# EAGLE board Control board FINAL (EAGLE 6.2), part 1 of 2
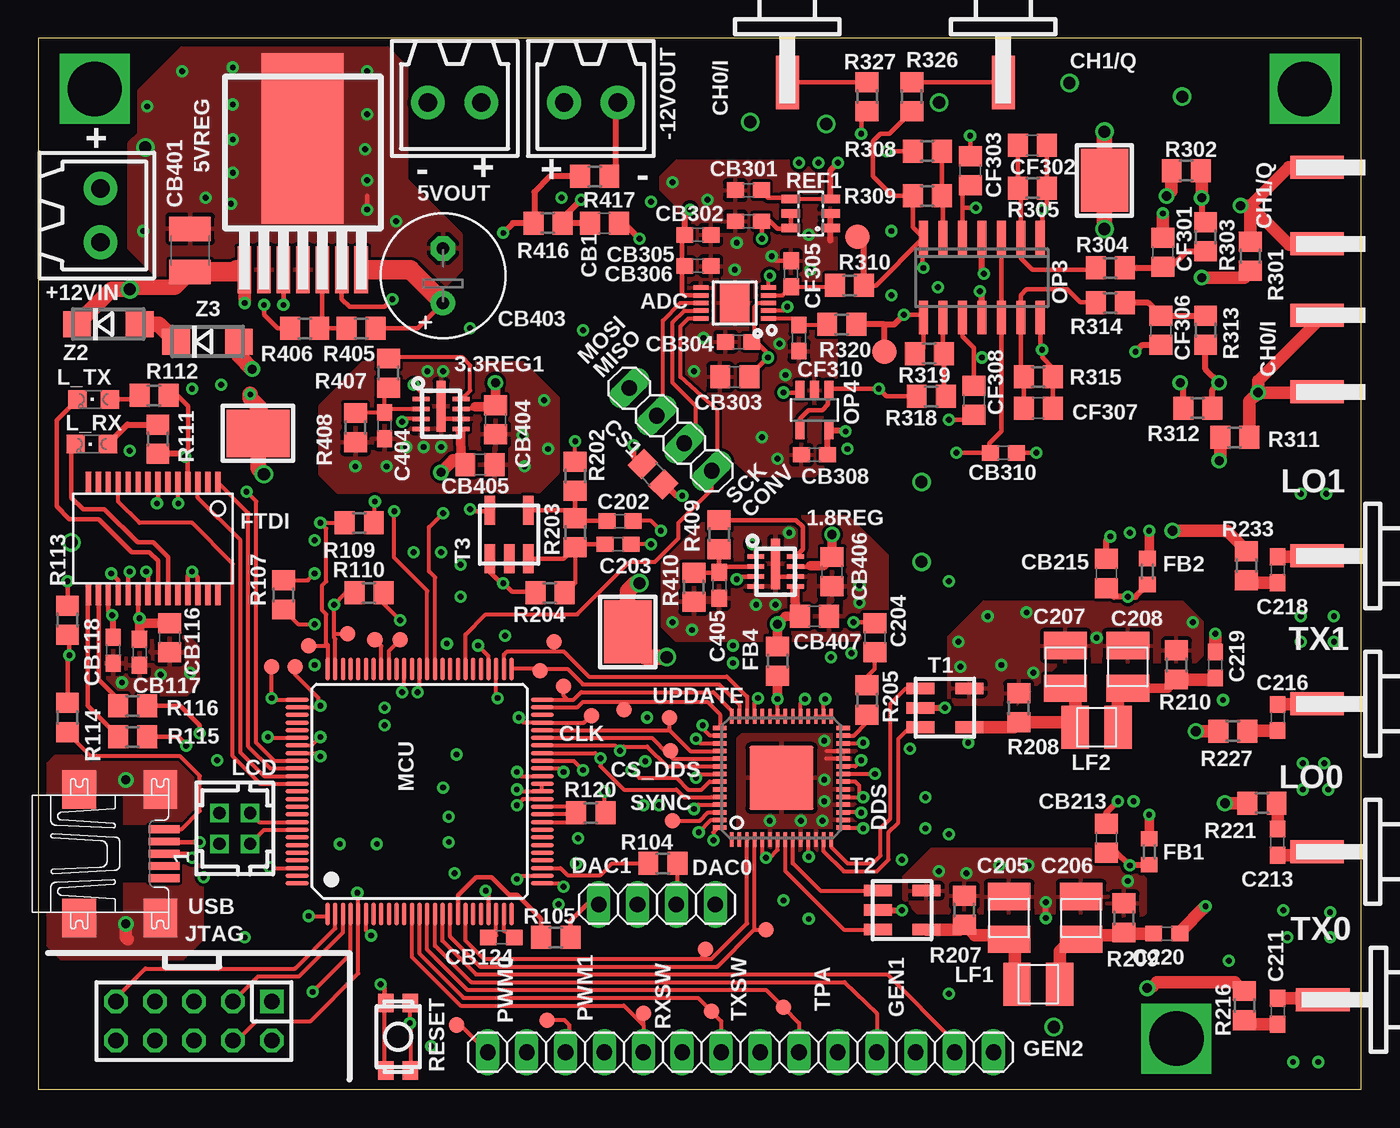
[diagram p4: board, top side]
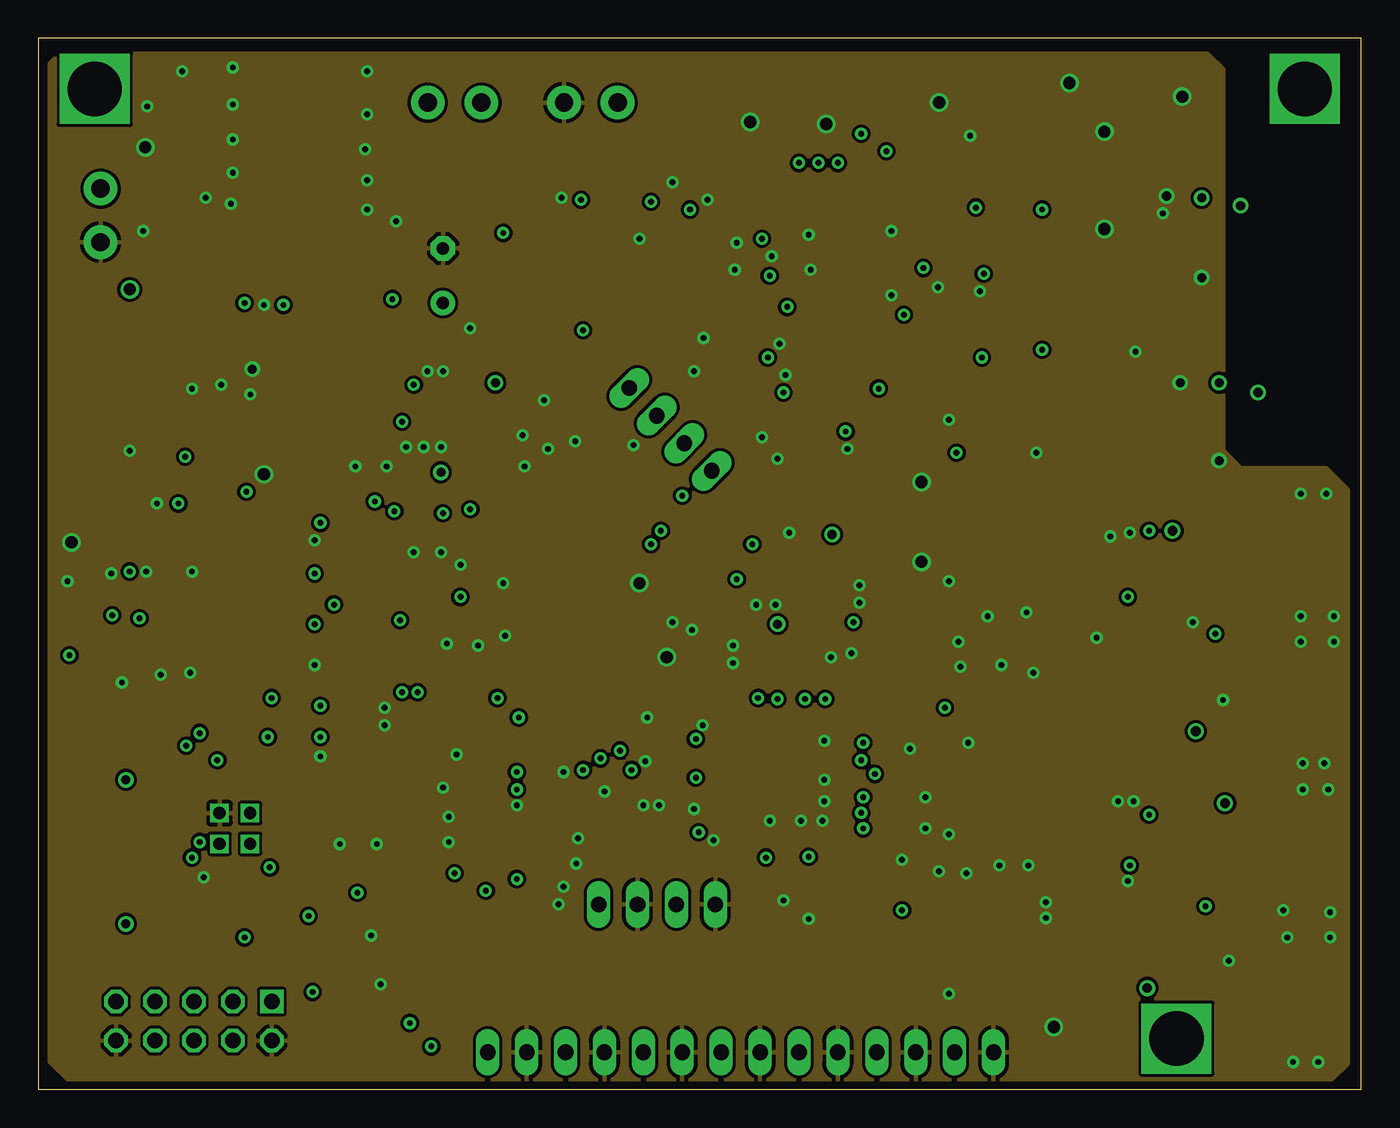
[diagram p5: board, inner layer Route2]
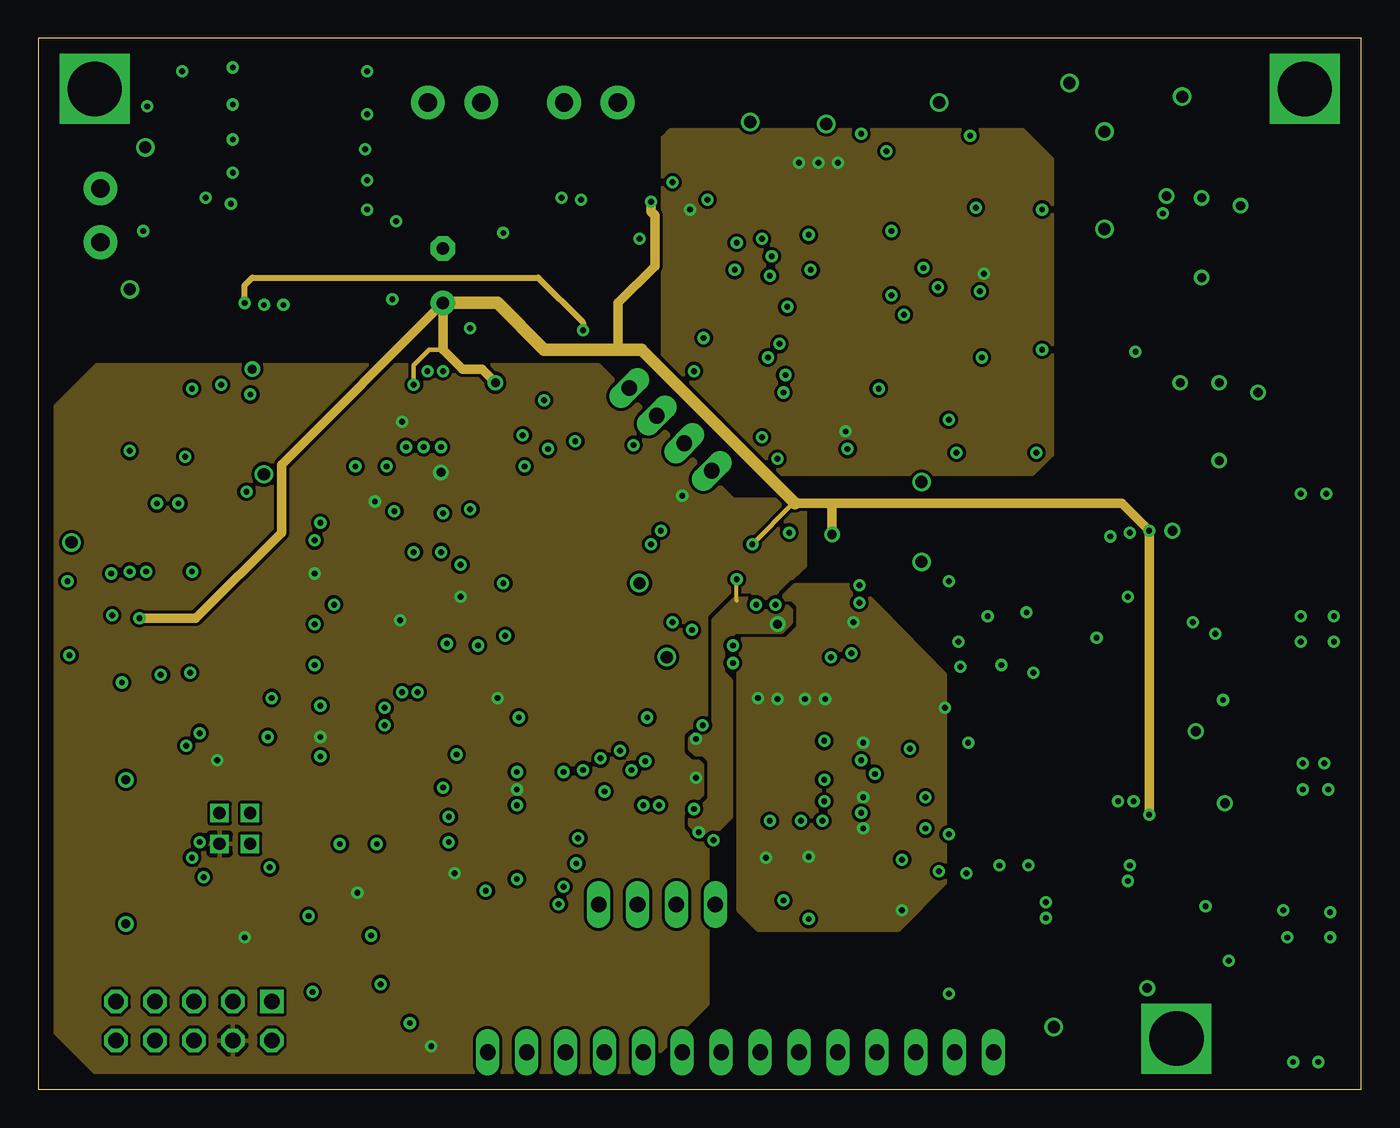
[diagram p6: board, inner layer Route15]
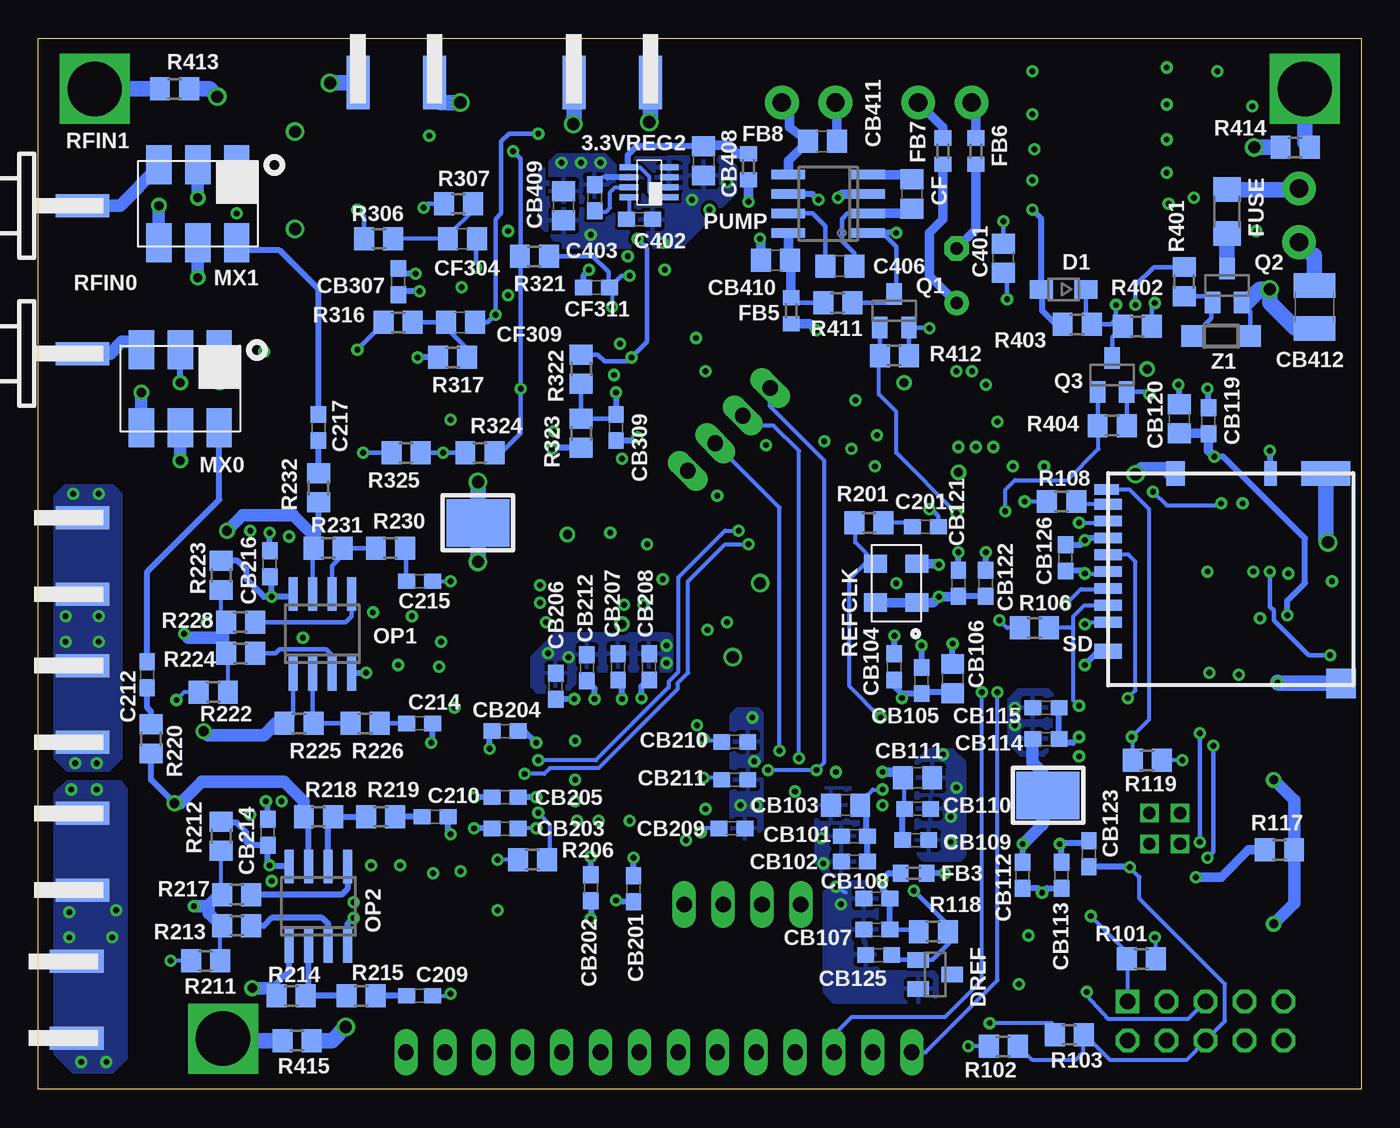
[diagram p7: board, bottom side, seen from below]

Size 86.36 x 68.58 mm. Coordinates in mm from the lower left corner, seen from the top.
Outline: 0,0 86.36,0 86.36,68.58 0,68.58 0,0
Copper layers (1*2+15*16): Top 0.035mm / dielectric 1.5mm / Route2 0.035mm / dielectric 0.15mm / Route15 0.035mm / dielectric 0.2mm / Bottom 0.035mm
Design rules: minimum track width 8mil, minimum drill 15mil, track to track 8mil, track to pad 8mil, pad to pad 8mil, via to via 8mil, smd to smd 8mil, copper to edge 20mil, drill to drill 8mil, minimum pad ring 8mil, minimum via ring 8mil, stop-mask expansion 2mil, vias tented up to drill 15mil, thermal gap 10mil
Net classes: 1 Highspeed digital: width 0.254 mm, drill 0.254 mm, clearance 0.203 mm; 2 Lowspeed digital: width 0.254 mm, drill 0.254 mm, clearance 0.203 mm

## Footprints (pad centres in the part's own frame; a part is rotated, then mirrored left to right if it is on the bottom)
LLP-8 = smd 0.6 x 3.3: EP 0,0.5 | smd 1.1 x 0.3: P$1 -1.3,0.975; P$2 -1.3,0.325; P$3 -1.3,-0.325; P$4 -1.3,-0.975; P$5 1.3,-0.975; P$6 1.3,-0.325; P$7 1.3,0.325; P$8 1.3,0.975
TSOT-8 = smd 0.4 x 1.22: 1 -0.975,-1.31; 2 -0.325,-1.31; 3 0.325,-1.31; 4 0.975,-1.31; 5 0.975,1.31; 6 0.325,1.31; 7 -0.325,1.31; 8 -0.975,1.31
OMNIMATE_SL_2POS = drill 1.2 pad 2.2: 1 -1.75,0; 2 1.75,0
TO-PMOD7 = smd 5.35 x 11.15: EP 0,8.575 | smd 0.9 x 3.07: P$1 -3.81,0; P$2 -2.54,0; P$3 -1.27,0; P$4 0,0; P$5 1.27,0; P$6 2.54,0; P$7 3.81,0
MSOP-10-EXP = smd 0.292 x 1: 1 -1,-2.2; 2 -0.5,-2.2; 3 0,-2.2; 4 0.5,-2.2; 5 1,-2.2; 6 1,2.2; 7 0.5,2.2; 8 0,2.2; 9 -0.5,2.2; 10 -1,2.2 | smd 2.5 x 1.9: EXP 0,0
C0603 = smd 1.1 x 1: 1 -0.85,0; 2 0.85,0
C0805 = smd 1.3 x 1.5: 1 -0.95,0; 2 0.95,0
1008 = smd 1.778 x 2.794: P$1 -1.397,0; P$2 1.397,0
C1210 = smd 1.6 x 2.7: 1 -1.4,0; 2 1.4,0
E3,5-8 = drill 0.813 pad 1.6: + -1.778,0 | drill 0.813 pad 1.6 octagon: - 1.778,0
SMC-EDGE = smd 3.5 x 1.5: 1 3.14,0 | smd 3.5 x 1.5 bottom: 2 3.14,2.5; 3 3.14,-2.5
TP10R = smd 1 x 1: TP 0,0
SOD323-W = smd 1.5 x 1.2: A 1.45,0; C -1.45,0
LFCSP-56 = smd 0.95 x 0.279: 1 -4.025,3.25; 2 -4.025,2.75; 3 -4.025,2.25; 4 -4.025,1.75; 5 -4.025,1.25; 6 -4.025,0.75; 7 -4.025,0.25; 8 -4.025,-0.25; 9 -4.025,-0.75; 10 -4.025,-1.25; 11 -4.025,-1.75; 12 -4.025,-2.25; 13 -4.025,-2.75; 14 -4.025,-3.25; 29 4.025,-3.25; 30 4.025,-2.75; 31 4.025,-2.25; 32 4.025,-1.75; 33 4.025,-1.25; 34 4.025,-0.75; 35 4.025,-0.25; 36 4.025,0.25; 37 4.025,0.75; 38 4.025,1.25; 39 4.025,1.75; 40 4.025,2.25; 41 4.025,2.75; 42 4.025,3.25 | smd 0.279 x 0.95: 15 -3.25,-4.025; 16 -2.75,-4.025; 17 -2.25,-4.025; 18 -1.75,-4.025; 19 -1.25,-4.025; 20 -0.75,-4.025; 21 -0.25,-4.025; 22 0.25,-4.025; 23 0.75,-4.025; 24 1.25,-4.025; 25 1.75,-4.025; 26 2.25,-4.025; 27 2.75,-4.025; 28 3.25,-4.025; 43 3.25,4.025; 44 2.75,4.025; 45 2.25,4.025; 46 1.75,4.025; 47 1.25,4.025; 48 0.75,4.025; 49 0.25,4.025; 50 -0.25,4.025; 51 -0.75,4.025; 52 -1.25,4.025; 53 -1.75,4.025; 54 -2.25,4.025; 55 -2.75,4.025; 56 -3.25,4.025 | smd 4.2 x 4.2: EXP 0,0
SOT23-3 = smd 1 x 1.4: 1 -0.95,-1.1; 2 0.95,-1.1; 3 0,1.1
R0603 = smd 1 x 1.1: 1 -0.85,0; 2 0.85,0
R0805 = smd 1.3 x 1.5: 1 -0.95,0; 2 0.95,0
SSOP28DB = smd 0.348 x 1.397: 1 -4.225,-3.656; 2 -3.575,-3.656; 3 -2.925,-3.656; 4 -2.275,-3.656; 5 -1.625,-3.656; 6 -0.975,-3.656; 7 -0.325,-3.656; 8 0.325,-3.656; 9 0.975,-3.656; 10 1.625,-3.656; 11 2.275,-3.656; 12 2.925,-3.656; 13 3.575,-3.656; 14 4.225,-3.656; 15 4.225,3.656; 16 3.575,3.656; 17 2.925,3.656; 18 2.275,3.656; 19 1.625,3.656; 20 0.975,3.656; 21 0.325,3.656; 22 -0.325,3.656; 23 -0.975,3.656; 24 -1.625,3.656; 25 -2.275,3.656; 26 -2.925,3.656; 27 -3.575,3.656; 28 -4.225,3.656
R1206 = smd 1.6 x 1.803: 1 -1.422,0; 2 1.422,0
1X04 = drill 1.016 long: 1 -3.81,0; 2 -1.27,0; 3 1.27,0; 4 3.81,0
1X14 = drill 1.016 long: 1 -16.51,0; 2 -13.97,0; 3 -11.43,0; 4 -8.89,0; 5 -6.35,0; 6 -3.81,0; 7 -1.27,0; 8 1.27,0; 9 3.81,0; 10 6.35,0; 11 8.89,0; 12 11.43,0; 13 13.97,0; 14 16.51,0
AVR-JTAG-10 = drill 1.016 square: 1 -5.08,-1.27 | drill 1.016 octagon: 2 -5.08,1.27; 3 -2.54,-1.27; 4 -2.54,1.27; 5 0,-1.27; 6 0,1.27; 7 2.54,-1.27; 8 2.54,1.27; 9 5.08,-1.27; 10 5.08,1.27
CHIPLED_0805 = smd 1.2 x 1.2: A 0,-1.05; C 0,1.05
DF11-4POS = drill 0.8 square: 1 1,-1; 2 1,1; 3 -1,-1; 4 -1,1
TQFP100 = smd 1.499 x 0.279: 1 -8,6; 2 -8,5.5; 3 -8,5; 4 -8,4.5; 5 -8,4; 6 -8,3.5; 7 -8,3; 8 -8,2.5; 9 -8,2; 10 -8,1.5; 11 -8,1; 12 -8,0.5; 13 -8,0; 14 -8,-0.5; 15 -8,-1; 16 -8,-1.5; 17 -8,-2; 18 -8,-2.5; 19 -8,-3; 20 -8,-3.5; 21 -8,-4; 22 -8,-4.5; 23 -8,-5; 24 -8,-5.5; 25 -8,-6; 51 8,-6; 52 8,-5.5; 53 8,-5; 54 8,-4.5; 55 8,-4; 56 8,-3.5; 57 8,-3; 58 8,-2.5; 59 8,-2; 60 8,-1.5; 61 8,-1; 62 8,-0.5; 63 8,0; 64 8,0.5; 65 8,1; 66 8,1.5; 67 8,2; 68 8,2.5; 69 8,3; 70 8,3.5; 71 8,4; 72 8,4.5; 73 8,5; 74 8,5.5; 75 8,6 | smd 0.279 x 1.499: 26 -6,-8; 27 -5.5,-8; 28 -5,-8; 29 -4.5,-8; 30 -4,-8; 31 -3.5,-8; 32 -3,-8; 33 -2.5,-8; 34 -2,-8; 35 -1.5,-8; 36 -1,-8; 37 -0.5,-8; 38 0,-8; 39 0.5,-8; 40 1,-8; 41 1.5,-8; 42 2,-8; 43 2.5,-8; 44 3,-8; 45 3.5,-8; 46 4,-8; 47 4.5,-8; 48 5,-8; 49 5.5,-8; 50 6,-8; 76 6,8; 77 5.5,8; 78 5,8; 79 4.5,8; 80 4,8; 81 3.5,8; 82 3,8; 83 2.5,8; 84 2,8; 85 1.5,8; 86 1,8; 87 0.5,8; 88 0,8; 89 -0.5,8; 90 -1,8; 91 -1.5,8; 92 -2,8; 93 -2.5,8; 94 -3,8; 95 -3.5,8; 96 -4,8; 97 -4.5,8; 98 -5,8; 99 -5.5,8; 100 -6,8
CD636 = smd 1.65 x 2.54: P$1 -2.54,-2.54; P$2 0,-2.54; P$3 2.54,-2.54; P$4 2.54,2.54; P$5 0,2.54; P$6 -2.54,2.54
SO08 = smd 0.6 x 2.2: 1 -1.905,-2.6; 2 -0.635,-2.6; 3 0.635,-2.6; 4 1.905,-2.6; 5 1.905,2.6; 6 0.635,2.6; 7 -0.635,2.6; 8 -1.905,2.6
SO14 = smd 0.6 x 2.2: 1 -3.81,-2.6; 2 -2.54,-2.6; 3 -1.27,-2.6; 4 0,-2.6; 5 1.27,-2.6; 6 2.54,-2.6; 7 3.81,-2.6; 8 3.81,2.6; 9 2.54,2.6; 10 1.27,2.6; 11 0,2.6; 12 -1.27,2.6; 13 -2.54,2.6; 14 -3.81,2.6
SOT23-5 = smd 0.6 x 1.2: 1 -0.95,-1.306; 2 0,-1.306; 3 0.95,-1.306; 4 0.95,1.306; 5 -0.95,1.306
SOIC-8 = smd 0.6 x 2.2: 1 -1.905,-2.6; 2 -0.635,-2.6; 3 0.635,-2.6; 4 1.905,-2.6; 5 1.905,2.6; 6 0.635,2.6; 7 -0.635,2.6; 8 -1.905,2.6
SOT23 = smd 1 x 1.4: 1 -0.95,-1.1; 2 0.95,-1.1; 3 0,1.1
SOT23-6 = smd 0.55 x 1.2: 1 -0.95,-1.3; 2 0,-1.3; 3 0.95,-1.3; 4 0.95,1.3; 5 0,1.3; 6 -0.95,1.3
QFN4_ASFLMP_OSCILLATOR = smd 1.2 x 1.5: P$1 -1.27,-1.35; P$2 1.27,-1.35; P$3 1.27,1.35; P$4 -1.27,1.35
KMR2_TACT_SWITCH = smd 1.2 x 1: P$1 2.2,0.8; P$2 2.2,-0.8; P$3 -2.2,0.8; P$4 -2.2,-0.8
DM3BT = smd 0.7 x 1.8: CD/DAT3 1.1,0.9; CLK 4.4,0.9; CMD 2.2,0.9; DAT0 6.6,0.9; DAT1 7.7,0.9; DAT2 0,0.9; VDD 3.3,0.9; VSS 5.5,0.9 | smd 1 x 1.8: M1 -1.9,0.9 | smd 1.9 x 1.9: M2 -4,-14.3 | smd 1.6 x 3.2: M3 9.7,-13.3 | smd 1.6 x 1.2: M4 9.7,-3.5 | smd 1.6 x 0.8: SWA 9.7,-9.7 | smd 0.7 x 1.6: SWB 8.65,1
CX20XX_BALUN = smd 0.762 x 1.905: P$1 1.27,-1.587; P$2 0,-1.587; P$3 -1.27,-1.587; P$4 -1.27,1.587; P$5 1.27,1.587
TP16R = smd 1.6 x 1.6: TP 0,0
SMD_TESTPAD = smd 4.1 x 3.1: P$1 0,0
UX60A-MB-5ST = smd 2 x 0.5: 1 2.25,1.6; 2 2.25,0.8; 3 2.25,0; 4 2.25,-0.8; 5 2.25,-1.6 | smd 2.2 x 2.5: M1 -3.3,-4.2; M2 -3.3,4.2; M3 2,4.2; M4 2,-4.2
SOD123 = smd 1.4 x 1.4: A 1.9,0; C -1.9,0
DO214AC = smd 1.8 x 1.7: A 2.05,0; C -2.05,0

## Placement (x,y rotation side)
1.8REG  LMZ1050X  [LLP-8]  48.13,33.78 0 top
3.3REG1  LMZ1050X  [LLP-8]  26.29,44.07 0 top
3.3VREG2  LT3060  [TSOT-8]  46.48,59.18 90 bottom
5VOUT  TERM-2OMNIMATE_SL  [OMNIMATE_SL_2POS]  27.18,64.39 180 top
5VREG  LMZ22003  [TO-PMOD7]  17.27,53.47 0 top
+12VIN  TERM-2OMNIMATE_SL  [OMNIMATE_SL_2POS]  4.06,57.02 270 top
-12VOUT  TERM-2OMNIMATE_SL  [OMNIMATE_SL_2POS]  36.07,64.39 180 top
ADC  LTC1407-1  [MSOP-10-EXP]  45.47,51.31 90 top
C201  100nF  [C0603]  28.45,36.7 180 bottom
C202  100nF  [C0603]  37.97,37.08 180 top
C203  100nF  [C0603]  37.85,35.56 180 top
C204  680pF  [C0805]  54.61,29.46 90 top
C205  68pF  [1008]  63.37,11.18 90 top
C206  68pF  [1008]  68.07,11.18 90 top
C207  68pF  [1008]  67.06,27.56 90 top
C208  68pF  [1008]  71.12,27.56 90 top
C209  100nF  [C0603]  61.47,6.1 0 bottom
C210  100nF  [C0603]  60.45,17.78 0 bottom
C211  100nF  [C0603]  80.9,5.08 270 top
C212  100nF  [C0603]  79.25,27.05 270 bottom
C213  100nF  [C0603]  80.9,16.13 90 top
C214  100nF  [C0603]  61.47,23.88 0 bottom
C215  100nF  [C0603]  61.47,33.15 0 bottom
C216  100nF  [C0603]  80.9,24.26 270 top
C217  100nF  [C0603]  68.07,43.18 270 bottom
C218  100nF  [C0603]  80.9,33.91 270 top
C219  100nF  [C0603]  76.83,27.69 270 top
C220  100nF  [C0603]  73.66,10.16 180 top
C401  0.47uF  [C0805]  23.37,54.23 90 bottom
C402  10nF  [C0603]  47.12,56.77 0 bottom
C403  10nF  [C0603]  50.04,58.17 270 bottom
C404  470pF  [C0603]  22.61,43.31 270 top
C405  470pF  [C0603]  44.45,32.89 270 top
C406  NP  [C0805]  34.04,53.72 0 bottom
CB1  10uF  [C0805]  36.96,56.52 0 top
CB101  33nF  [C0603]  33.08,16.51 180 bottom
CB102  100nF  [C0603]  33.08,14.86 180 bottom
CB103  4.7uF  [C0805]  33.66,18.54 180 bottom
CB104  33nF  [C0603]  30.48,27.56 90 bottom
CB105  100nF  [C0603]  28.7,26.67 90 bottom
CB106  4.7uF  [C0805]  26.67,26.8 90 bottom
CB107  33nF  [C0603]  31.62,10.41 180 bottom
CB108  100nF  [C0603]  31.62,12.45 180 bottom
CB109  470p  [C0603]  29.08,16.26 0 bottom
CB110  33nF  [C0603]  28.96,18.29 0 bottom
CB111  4.7uF  [C0805]  28.96,20.32 0 bottom
CB112  33nF  [C0603]  22.1,13.97 90 bottom
CB113  100nF  [C0603]  19.56,13.97 90 bottom
CB114  33nF  [C0603]  20.57,22.86 180 bottom
CB115  100nF  [C0603]  20.57,24.89 180 bottom
CB116  4.7uF  [C0805]  8.57,29.46 270 top
CB117  100nF  [C0603]  6.6,28.51 270 top
CB118  100nF  [C0603]  4.89,28.64 270 top
CB119  100nF  [C0603]  9.97,43.62 90 bottom
CB120  4.7uF  [C0805]  11.87,43.75 90 bottom
CB121  10nF  [C0603]  26.29,33.02 90 bottom
CB122  100nF  [C0603]  24.51,33.02 90 bottom
CB123  10nF  [C0603]  17.78,15.37 90 bottom
CB124  100nF  [C0603]  30.23,9.91 0 top
CB125  1uF  [C0603]  31.5,8.76 180 bottom
CB126  1uF  [C0603]  19.3,34.67 90 bottom
CB201  100nF  [C0603]  47.5,13.08 270 bottom
CB202  100nF  [C0603]  50.29,13.14 270 bottom
CB203  100nF  [C0603]  55.88,17.02 180 bottom
CB204  100nF  [C0603]  55.88,23.37 180 bottom
CB205  100nF  [C0603]  55.88,19.05 180 bottom
CB206  100nF  [C0603]  52.58,26.29 90 bottom
CB207  100nF  [C0603]  48.51,27.56 90 bottom
CB208  100nF  [C0603]  46.48,27.56 90 bottom
CB209  100nF  [C0603]  41.08,17.02 0 bottom
CB210  100nF  [C0603]  40.89,22.67 0 bottom
CB211  100nF  [C0603]  40.89,20.19 0 bottom
CB212  100nF  [C0603]  50.55,27.5 90 bottom
CB213  1uF  [C0805]  69.72,16.38 90 top
CB214  100nF  [C0603]  71.37,16.76 90 bottom
CB215  1uF  [C0805]  69.72,33.66 90 top
CB216  100nF  [C0603]  71.25,34.29 90 bottom
CB301  1uF  [C0603]  46.35,58.67 180 top
CB302  100nF  [C0603]  46.35,56.64 180 top
CB303  10uF  [C0805]  45.47,46.48 180 top
CB304  100nF  [C0603]  45.72,48.77 180 top
CB305  1uF  [C0603]  43.05,55.75 0 top
CB306  100nF  [C0603]  43.05,53.72 0 top
CB307  100nF  [C0603]  62.87,52.7 270 bottom
CB308  100nF  [C0603]  50.67,41.4 180 top
CB309  100nF  [C0603]  48.64,43.18 270 bottom
CB310  100nF  [C0603]  62.99,41.53 0 top
CB401  22uF  [C1210]  9.91,54.74 90 top
CB403  220uF  [E3,5-8]  26.42,53.09 90 top
CB404  10uF  [C0805]  29.84,43.69 270 top
CB405  10uF  [C0805]  28.83,40.77 0 top
CB406  10uF  [C0805]  51.82,33.78 270 top
CB407  10uF  [C0805]  50.67,30.86 0 top
CB408  1uF  [C0805]  42.93,60.58 270 bottom
CB409  4.7uF  [C0805]  52.07,57.66 270 bottom
CB410  10uF  [C0805]  38.23,54.1 180 bottom
CB411  10uF  [C0805]  35.18,61.85 0 bottom
CB412  22uF  [C1210]  3.05,51.05 90 bottom
CF  10uF  [C0805]  29.34,58.42 90 bottom
CF301  220pF  [C0805]  73.41,54.61 90 top
CF302  33pF  [C0805]  64.9,61.59 180 top
CF303  220pF  [C0805]  60.83,59.94 90 top
CF304  220pF  [C0805]  58.67,55.5 180 bottom
CF305  47pF  [C0603]  49.15,53.21 90 top
CF306  220pF  [C0805]  73.28,49.53 270 top
CF307  33pF  [C0805]  65.28,44.45 180 top
CF308  220pF  [C0805]  61.09,44.96 270 top
CF309  220pF  [C0805]  58.8,50.04 180 bottom
CF310  47pF  [C0603]  49.66,49.02 270 top
CF311  10n  [C0603]  49.91,52.32 180 bottom
CH0/I  BNC-EDGESMC  [SMC-EDGE]  48.9,68.83 270 top
CH1/Q  BNC-EDGESMC  [SMC-EDGE]  62.99,68.83 270 top
CLK  TPSTP10R  [TP10R]  36.13,24.38 0 top
CS1  100pF  [C0805]  40.13,40.13 135 top
CS_DDS  TPSTP10R  [TP10R]  41.27,22.1 0 top
CS_SD  TPSTP10R  [TP10R]  16.76,27.56 0 top
D1  NP  [SOD323-W]  19.43,52.2 180 bottom
DDS  AD9958  [LFCSP-56]  48.51,20.32 90 top
DDSPDN  TPSTP10R  [TP10R]  47.5,10.41 0 top
DDSRESET  TPSTP10R  [TP10R]  43.56,9.14 0 top
DREF  ADR5041  [SOT23-3]  27.81,7.49 270 bottom
FB1  [R0603]  72.52,15.49 270 top
FB2  [R0603]  72.39,33.78 270 top
FB3  [R0603]  29.21,14.1 0 bottom
FB4  [R0805]  48.26,27.94 90 top
FB5  [R0603]  37.21,50.8 270 bottom
FB6  [R0603]  25.15,61.21 90 bottom
FB7  [R0603]  27.3,61.21 90 bottom
FB8  [R0603]  40.01,60.2 270 bottom
FTDI  [SSOP28DB]  7.49,35.94 180 top
FUSE  1206LXXXWR  [R1206]  8.76,57.28 90 bottom
GCLK0  TPSTP10R  [TP10R]  23.62,29.34 0 top
GCLK1  TPSTP10R  [TP10R]  21.97,29.34 0 top
JP1  [1X04]  40.39,12.06 0 top
JP3  [1X14]  45.85,2.41 180 top
JP5  [1X04]  41.27,43.05 135 top
JTAG  AVR-JTAG-10  [AVR-JTAG-10]  10.16,4.45 180 top
L_RX  [CHIPLED_0805]  3.49,42.1 90 top
L_TX  [CHIPLED_0805]  3.62,45.02 90 top
LCD  PINHEAD-4DF11  [DF11-4POS]  12.83,17.02 270 top
LF1  330nH  [1008]  65.28,6.86 0 top
LF2  330nH  [1008]  69.09,23.62 0 top
LO0  BNC-EDGESMC  [SMC-EDGE]  86.61,15.49 180 top
LO1  BNC-EDGESMC  [SMC-EDGE]  86.61,34.8 180 top
MCU  AT32UC3C1512/1256/1128  [TQFP100]  24.89,19.43 90 top
MISO0  TPSTP10R  [TP10R]  17.65,28.96 0 top
MOSI0  TPSTP10R  [TP10R]  20.19,29.72 0 top
MX0  ADE-1LH  [CD636]  77.09,45.72 180 bottom
MX1  ADE-1LH  [CD636]  75.95,57.78 180 bottom
OP1  AD8008  [SO08]  67.82,29.72 0 bottom
OP2  AD8008  [SO08]  68.07,11.94 0 bottom
OP3  LT1802  [SO14]  61.59,52.96 180 top
OP4  AD8605  [SOT23-5]  50.67,44.32 180 top
P0  TPSTP10R  [TP10R]  33.66,29.21 0 top
P1  TPSTP10R  [TP10R]  32.77,27.3 0 top
P2  TPSTP10R  [TP10R]  34.29,26.29 0 top
P3  TPSTP10R  [TP10R]  38.23,24.77 0 top
PUMP  LT1054  [SOIC-8]  34.8,57.78 90 bottom
Q1  BSS123  [SOT23]  30.48,50.8 0 bottom
Q2  ZXMP6A13FTA  [SOT23]  8.76,52.45 0 bottom
Q3  BSS123  [SOT23]  16.26,46.61 0 bottom
R101  11K  [R0805]  14.35,8.51 0 bottom
R102  11k  [R0805]  23.37,2.79 0 bottom
R103  100  [R0805]  19.05,3.56 180 bottom
R104  [R0805]  40.77,14.73 180 top
R105  [R0805]  33.78,9.91 180 top
R106  10k  [R0805]  21.34,30.1 0 bottom
R107  10k  [R0805]  16,32.26 270 top
R108  10k  [R0805]  19.56,38.35 0 bottom
R109  10k  [R0805]  20.95,36.96 180 top
R110  10k  [R0805]  21.59,32.38 180 top
R111  162  [R0805]  7.81,42.42 90 top
R112  162  [R0805]  7.56,45.28 180 top
R113  10K  [R0805]  1.91,30.61 90 top
R114  4.7K  [R0805]  1.91,24.26 270 top
R115  0  [R0805]  6.16,22.99 0 top
R116  0  [R0805]  6.16,25.02 0 top
R117  0  [R0805]  5.33,15.62 180 bottom
R118  1K  [R0805]  27.94,10.29 0 bottom
R119  39  [R0805]  13.97,21.46 180 bottom
R120  0  [R0805]  36.07,18.03 180 top
R201  100  [R0805]  32.13,36.96 180 bottom
R202  220  [R0805]  35.05,40.01 270 top
R203  330  [R0805]  35.05,36.32 270 top
R204  220  [R0805]  33.4,32.38 180 top
R205  0  [R0805]  54.1,25.4 270 top
R206  2k  [R0805]  54.1,14.99 0 bottom
R207  49.9  [R0805]  60.45,11.68 270 top
R208  49.9  [R0805]  64.01,24.89 270 top
R209  49.9  [R0805]  70.87,11.18 270 top
R210  49.9  [R0805]  74.3,27.69 270 top
R211  13k  [R0805]  75.44,8.38 0 bottom
R212  13k  [R0805]  74.42,16.51 90 bottom
R213  200  [R0805]  73.41,10.67 180 bottom
R214  511  [R0805]  69.85,6.1 0 bottom
R215  100  [R0805]  65.28,6.1 0 bottom
R216  49.9  [R0805]  78.74,5.46 90 top
R217  200  [R0805]  73.41,12.7 180 bottom
R218  511  [R0805]  68.07,17.78 0 bottom
R219  100  [R0805]  64.01,17.78 0 bottom
R220  49.9  [R0805]  78.99,22.86 270 bottom
R221  49.9  [R0805]  79.88,18.67 180 top
R222  13k  [R0805]  74.93,25.91 0 bottom
R223  13k  [R0805]  74.42,33.53 90 bottom
R224  200  [R0805]  73.15,28.45 180 bottom
R225  511  [R0805]  69.34,23.88 0 bottom
R226  100  [R0805]  65.02,23.88 0 bottom
R227  49.9  [R0805]  77.98,23.37 180 top
R228  200  [R0805]  73.15,30.48 180 bottom
R230  100  [R0805]  63.37,35.31 0 bottom
R231  511  [R0805]  67.44,35.31 0 bottom
R232  49.9  [R0805]  68.07,39.24 270 bottom
R233  49.9  [R0805]  78.87,34.16 90 top
R301  NP  [R0805]  79.12,54.36 90 top
R302  49.9  [R0805]  74.93,59.94 0 top
R303  976  [R0805]  76.2,55.63 270 top
R304  1k  [R0805]  69.98,53.59 180 top
R305  20k  [R0805]  64.9,58.8 0 top
R306  2.74k  [R0805]  64.14,55.5 0 bottom
R307  2.74k  [R0805]  58.93,57.78 180 bottom
R308  1.82k  [R0805]  58.04,61.21 180 top
R309  1K  [R0805]  58.04,58.29 0 top
R310  51  [R0805]  52.96,52.45 180 top
R311  NP  [R0805]  78.11,42.55 0 top
R312  49.9  [R0805]  75.69,44.45 0 top
R313  976  [R0805]  76.2,49.53 90 top
R314  1k  [R0805]  69.98,51.31 180 top
R315  20k  [R0805]  65.28,46.48 0 top
R316  2.74k  [R0805]  62.87,50.04 0 bottom
R317  2.74k  [R0805]  59.31,47.75 180 bottom
R318  1.82k  [R0805]  58.29,45.21 180 top
R319  1k  [R0805]  58.17,48.01 0 top
R320  51  [R0805]  52.45,49.91 180 top
R321  51  [R0805]  53.98,54.36 180 bottom
R322  10k  [R0805]  50.93,46.99 90 bottom
R323  10k  [R0805]  50.93,42.8 270 bottom
R324  10k  [R0805]  57.53,41.53 0 bottom
R325  1k  [R0805]  62.36,41.53 180 bottom
R326  49.9  [R0805]  57.02,64.77 270 top
R327  49.9  [R0805]  54.1,64.77 270 top
R401  110k  [R0805]  11.56,52.7 270 bottom
R402  30.1k  [R0805]  14.61,49.78 180 bottom
R403  4.99k  [R0805]  18.54,49.91 180 bottom
R404  10K  [R0805]  16.26,43.31 0 bottom
R405  6.81K  [R0805]  21.08,49.66 180 top
R406  1.3K  [R0805]  17.4,49.66 180 top
R407  162k  [R0805]  22.86,46.74 270 top
R408  210k  [R0805]  20.7,43.18 270 top
R409  249k  [R0805]  44.45,36.2 90 top
R410  110k  [R0805]  42.8,32.77 90 top
R411  NP  [R0805]  34.16,51.31 0 bottom
R412  10K  [R0805]  30.48,47.88 0 bottom
R413  [R0805]  77.47,65.28 0 bottom
R414  [R0805]  4.32,61.47 180 bottom
R415  [R0805]  69.47,3.17 0 bottom
R416  21K  [R0805]  33.27,56.52 0 top
R417  249K  [R0805]  36.32,59.56 0 top
REF1  REF3230AIDBVT  [SOT23-6]  50.42,57.15 90 top
REFCLK  OSCILLATORASFLMP  [QFN4_ASFLMP_OSCILLATOR]  30.35,33.02 90 bottom
RESET  TACT_SW  [KMR2_TACT_SWITCH]  23.5,3.43 90 top
RFIN0  BNC-EDGESMC  [SMC-EDGE]  86.61,48.01 0 bottom
RFIN1  BNC-EDGESMC  [SMC-EDGE]  86.61,57.66 0 bottom
SCK0  TPSTP10R  [TP10R]  15.24,27.56 0 top
SD  DM3BT  [DM3BT]  15.62,30.48 90 bottom
SYNC  TPTP10R  [TP10R]  41.4,17.53 0 top
T1  CX2045  [CX20XX_BALUN]  59.18,24.89 270 top
T2  CX2045  [CX20XX_BALUN]  56.39,11.68 270 top
T3  RFXF9503  [CX20XX_BALUN]  30.73,36.2 0 top
TP1  TPSTP10R  [TP10R]  33.21,4.51 0 top
TP2  TPSTP10R  [TP10R]  27.3,4.19 0 top
TP3  TPSTP10R  [TP10R]  43.94,5.08 0 top
TP4  TPSTP10R  [TP10R]  39.5,4.95 0 top
TP5  TPSTP10R  [TP10R]  48.64,5.33 0 top
TP6  TPSQTP16R  [TP16R]  55.24,48.13 0 top
TP9  TPSQTP16R  [TP16R]  53.47,55.63 0 top
TX0  BNC-EDGESMC  [SMC-EDGE]  87,5.84 180 top
TX1  BNC-EDGESMC  [SMC-EDGE]  86.61,25.15 180 top
U$1  TESTPOINTKEYSTONE_ELECTRONICS_5016  [SMD_TESTPAD]  14.35,42.8 180 top
U$2  TESTPOINTKEYSTONE_ELECTRONICS_5016  [SMD_TESTPAD]  69.6,59.31 90 top
U$3  TESTPOINTKEYSTONE_ELECTRONICS_5016  [SMD_TESTPAD]  57.66,36.96 0 bottom
U$4  TESTPOINTKEYSTONE_ELECTRONICS_5016  [SMD_TESTPAD]  20.45,19.18 180 bottom
U$5  TESTPOINTKEYSTONE_ELECTRONICS_5016  [SMD_TESTPAD]  38.48,29.84 90 top
UPDATE  TPSTP10R  [TP10R]  41.21,24.26 0 top
USB  MINI-USB-SHIELD-UX60A-MB-5ST  [UX60A-MB-5ST]  5.97,15.37 0 top
Z1  9.1V  [SOD123]  9.14,49.15 180 bottom
Z2  9.1V  [DO214AC]  4.57,49.91 0 top
Z3  9.1V  [DO214AC]  11.05,48.77 0 top